# EAGLE design USB2RS485 (EAGLE 6.2)
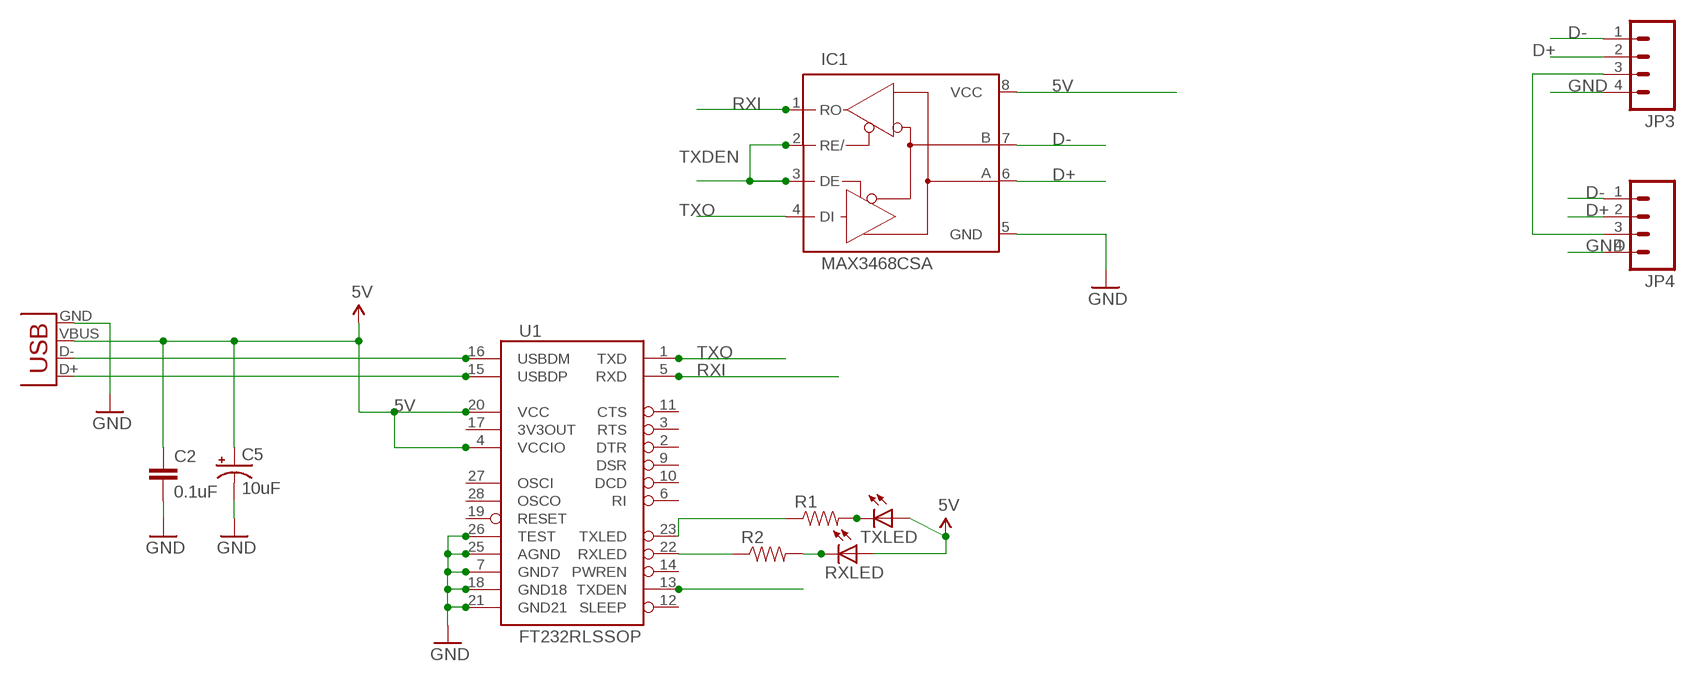
[diagram p0: schematic, sheet 1]

## Parts
C2  0.1uF  CAP0402-CAP  [0402-CAP]
C5  10uF  CAP_POL1206  [EIA3216]
IC1  MAX3468CSA  [SO08]
JP3  M04LOCK_LONGPADS  [1X04_LOCK_LONGPADS]
JP4  M04LOCK_LONGPADS  [1X04_LOCK_LONGPADS]
R1  RESISTOR0603-RES  [0603-RES]
R2  RESISTOR0603-RES  [0603-RES]
RXLED  LED0603  [LED-0603]
TXLED  LED0603  [LED-0603]
U1  FT232RLSSOP  [SSOP28DB]
X2  USB-SMD-NS  [USB-MINIB-NOSTOP]

## Nets
5V: C2.1 C5.A(+) IC1.8(VCC) RXLED.A TXLED.A U1.4(VCCIO) U1.20(VCC) X2.VBUS
D+: IC1.6(A) JP3.2 JP4.2
D-: IC1.7(B) JP3.1 JP4.1
GND [power]: C2.2 C5.C(-) IC1.5(GND) JP3.4 JP4.4 U1.7(GND7) U1.18(GND18) U1.21(GND21) U1.25(AGND) U1.26(TEST) X2.GND
N$1: R1.1 U1.23(TXLED)
N$2: R2.1 U1.22(RXLED)
N$3: R1.2 TXLED.C
N$4: JP3.3 JP4.3
N$6: R2.2 RXLED.C
RXI: IC1.1(RO) U1.5(RXD)
TXDEN: IC1.2(RE/) IC1.3(DE) U1.13(TXDEN)
TXO: IC1.4(DI) U1.1(TXD)
USB_D+: U1.15(USBDP) X2.D+
USB_D-: U1.16(USBDM) X2.D-
Unconnected: U1.2(DTR) U1.3(RTS) U1.6(RI) U1.9(DSR) U1.10(DCD) U1.11(CTS) U1.12(SLEEP) U1.14(PWREN) U1.17(3V3OUT) U1.19(RESET) U1.27(OSCI) U1.28(OSCO)

## Library data of the parts
C2 = SparkFun:CAP: Capacitor Standard 0603 ceramic capacitor, and 0.1" leaded capacitor.
C5 = SparkFun:CAP_POL: Capacitor Polarized These are standard SMD and PTH capacitors. Normally 10uF, 47uF, and 100uF in electrolytic and tantalum varieties. Always verify the external diameter of the through hole cap, it varies with capacity, voltage, and manufacturer. The EIA devices should be standard.
IC1 = maxim:MAX34*: +5V, Fail-Safe, 40Mbps, Profibus RS-485/RS-422 Transceivers Source: MAX3465-MAX3469.pdf; MPN: MAX3468CSA+; OC_FARNELL: unknown; OC_NEWARK: 76K6721
JP3 JP4 = SparkFun-Connectors:M04: Header 4 Standard 4-pin 0.1" header. Use with straight break away headers (SKU : PRT-00116), right angle break away headers (PRT-00553), swiss pins (PRT-00743), machine pins (PRT-00117), and female headers (PRT-00115). Molex polarized connector foot print use with SKU : PRT-08231 with associated crimp pins and housings. 1MM SMD Version SKU: PRT-10208
R1 R2 = SparkFun-Passives:RESISTOR: Resistor Basic schematic elements and footprints for 0603, 1206, and PTH resistors.
RXLED TXLED = SparkFun-LED:LED: LEDs Standard schematic elements and footprints for 5mm, 3mm, 1206, and 0603 sized LEDs. 5mm - Spark Fun Electronics SKU : COM-00529 (and others)
U1 = SparkFun:FT232RL: USB UART FT232RL 4th Generation USB UART (USB <-> Serial) Controller. Spark Fun Electronics SKU : COM-00650
X2 = SparkFun:USB: USB Connectors USB-B-PTH is fully proven SKU : PRT-00139 USB-miniB is fully proven SKU : PRT-00587 USB-A-PCB is untested. USB-A-H is throughly reviewed, but untested. Spark Fun Electronics SKU : PRT-00437 USB-B-SMT is throughly reviewed, but untested. Needs silkscreen touching up. USB-A-S has not been used/tested USB-MB-H has not been used/tested

## Net classes
0 default: width 0.203 mm
1 power: width 0.254 mm

## Board
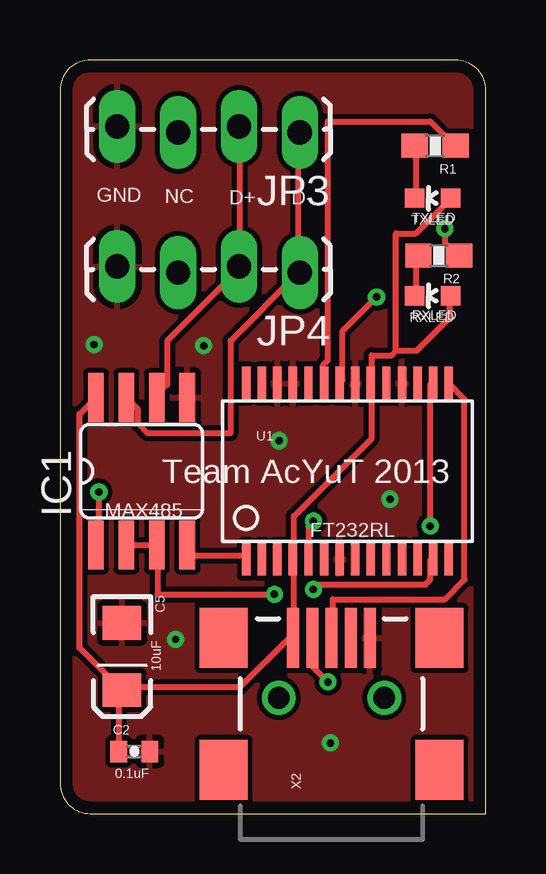
[diagram p1: board, top side]
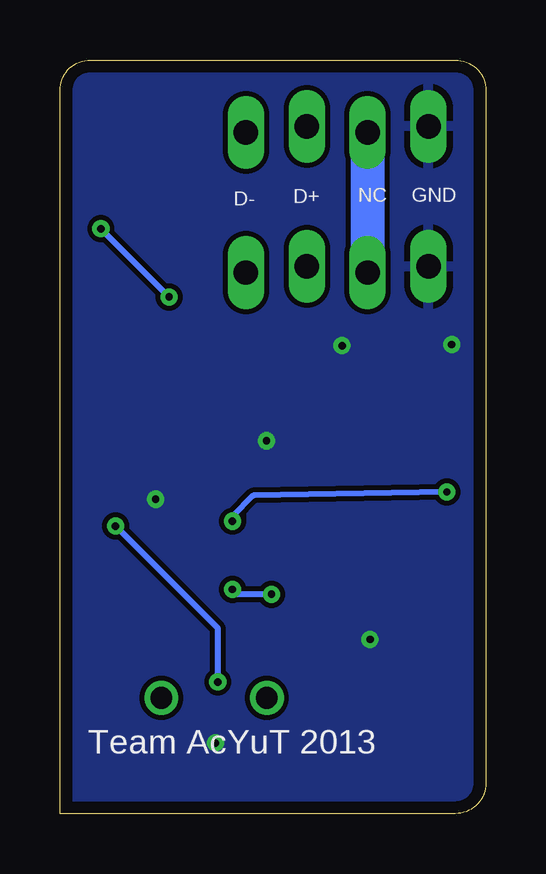
[diagram p2: board, bottom side, seen from below]

Size 17.76 x 31.42 mm. Coordinates in mm from the lower left corner, seen from the top.
Outline: 16.49,31.42 1.27,31.42 arc90 0,30.15 0,1.27 arc90 1.27,0 17.76,0 17.76,30.15 arc90 16.49,31.42
Copper layers (1*16): Top 0.035mm / dielectric 1.5mm / Bottom 0.035mm
Design rules: minimum track width 10mil, minimum drill 12mil, track to track 8mil, track to pad 8mil, pad to pad 8mil, via to via 8mil, smd to smd 8mil, copper to edge 20mil, drill to drill 8mil, minimum pad ring 10mil, minimum via ring 8mil, stop-mask expansion 4mil, vias tented up to drill 13mil, thermal gap 10mil

### Footprints (pad centres in the part's own frame; a part is rotated, then mirrored left to right if it is on the bottom)
0402-CAP = smd 0.7 x 0.9: 1 -0.65,0; 2 0.65,0
EIA3216 = smd 1.4 x 1.6: A 1.4,0; C -1.4,0
SO08 = smd 0.66 x 2.032: 1 -1.905,-3.073; 2 -0.635,-3.073; 3 0.635,-3.073; 4 1.905,-3.073; 5 1.905,3.073; 6 0.635,3.073; 7 -0.635,3.073; 8 -1.905,3.073
1X04_LOCK_LONGPADS = drill 1.016 long: 1 0,0; 2 2.54,-0.254; 3 5.08,0; 4 7.62,-0.254
0603-RES = smd 1.1 x 1: 1 -0.85,0; 2 0.85,0
LED-0603 = smd 0.8 x 0.8: A 0,-0.75; C 0,0.75
SSOP28DB = smd 0.348 x 1.397: 1 -4.225,-3.656; 2 -3.575,-3.656; 3 -2.925,-3.656; 4 -2.275,-3.656; 5 -1.625,-3.656; 6 -0.975,-3.656; 7 -0.325,-3.656; 8 0.325,-3.656; 9 0.975,-3.656; 10 1.625,-3.656; 11 2.275,-3.656; 12 2.925,-3.656; 13 3.575,-3.656; 14 4.225,-3.656; 15 4.225,3.656; 16 3.575,3.656; 17 2.925,3.656; 18 2.275,3.656; 19 1.625,3.656; 20 0.975,3.656; 21 0.325,3.656; 22 -0.325,3.656; 23 -0.975,3.656; 24 -1.625,3.656; 25 -2.275,3.656; 26 -2.925,3.656; 27 -3.575,3.656; 28 -4.225,3.656
USB-MINIB-NOSTOP = smd 2.5 x 0.5: D+ 2.5,0; D- 2.5,0.8; GND 2.5,-1.6; ID 2.5,-0.8; VBUS 2.5,1.6 | smd 2.5 x 2: G1 -3,-4.5; G2 -3,4.5; G3 2.5,4.5; G4 2.5,-4.5 | drill 0.9 pad 0.8: H1 0,2.2 | drill 0.9 pad 0.787: H2 0,-2.2

### Placement (x,y rotation side)
C2  3.1,2.59 0 top
C5  2.59,6.55 270 top
IC1  3.4,14.27 0 top
JP3  10.01,28.4 180 top
JP4  10.01,22.56 180 top
R1  15.65,27.84 180 top
R2  15.8,23.27 180 top
RXLED  15.54,21.59 90 top
TXLED  15.54,25.65 90 top
U1  11.99,14.27 0 top
X2  11.33,4.83 90 top

### Tracks (layer width: path | path; a pad name or v marks a point on that pad's centre or on a via)
5V
  Top 0.254: 14.02,19.3 13.82,19.1 13.01,19.1 13.01,18.09 U1.20 13.01,17.88 13.01,15.65 9.75,12.39 9.75,10.77 U1.4 9.75,10.57 9.75,7.52 X2.VBUS 9.55,7.32 7.52,5.28 2.64,5.28 C5.A | 14.02,19.3 14.88,19.3 16.26,20.68 16.26,21.54 RXLED.A | 14.02,19.3 14.02,24.18 14.83,24.18 16.26,25.6 TXLED.A | C2.1 2.44,2.64 2.44,5.08 C5.A | IC1.8 0.81,16.66 0.81,6.91 2.44,5.28 C5.A
D+
  Top 0.254: IC1.6 4.06,17.48 4.47,17.88 4.47,19.71 7.32,22.55 7.32,22.76 JP4.2 7.52,22.96 7.52,28.65 JP3.2
D-
  Top 0.254: IC1.7 3.25,16.87 3.25,16.26 3.66,15.85 7.11,15.85 7.11,19.71 9.96,22.55 | 9.96,22.55 9.96,28.25 JP3.1 | 9.96,22.55 JP4.1
GND  (via drill 0.3)
  other vias: 1.42,19.56 13.77,13.11 9.14,15.54 11.28,2.95 5.99,19.51 4.83,7.26
  pour Top: 17.53,0.25 -0.08,0 0.17,31.1 17.53,31.09
  pour Bottom: 17.48,31.39 17.58,0.1 1.37,0.1 arc-90 0.1,1.37 0,31.09
N$1
  Top 0.254: R1.1 16.46,27.84 15.44,28.85 11.18,28.85 11.18,18.9 10.97,18.69 10.97,18.09 U1.23
N$2  (via drill 0.3)
  Top 0.254: v16.05,24.38 16.05,23.77 16.46,23.37 R2.1 | v13.21,21.54 11.79,20.12 11.79,18.09 U1.22
  Bottom 0.254: v13.21,21.54 v16.05,24.38
N$3
  Top 0.254: TXLED.C 14.83,25.81 14.83,27.84 R1.2
N$4
  Bottom 1.422: JP3.3 JP4.3
N$6
  Top 0.254: 14.83,21.54 RXLED.C 14.83,21.74 14.83,23.16 R2.2
RXI  (via drill 0.3)
  Top 0.254: v10.57,12.19 10.36,11.99 10.36,10.77 U1.5 | v1.63,13.41 1.63,11.38 IC1.1
  Bottom 0.254: v1.63,13.41 9.7,13.26 10.57,12.39 v10.57,12.19
TXDEN  (via drill 0.3)
  Top 0.254: v10.57,9.35 10.57,9.55 15.24,9.55 15.44,9.75 15.44,10.57 U1.13 | v8.94,9.14 4.06,9.14 4.06,11.18 IC1.3 3.86,11.18 2.85,11.18 IC1.2
  Bottom 0.254: v10.57,9.35 10.36,9.14 v8.94,9.14
TXO
  Top 0.254: U1.1 7.72,10.77 5.49,10.77 5.49,11.18 IC1.4
USB_D+
  Top 0.254: U1.15 16.26,17.88 16.87,17.27 16.87,9.75 16.05,8.94 11.38,8.94 11.38,7.52 X2.D+
USB_D-  (via drill 0.3)
  Top 0.254: v15.44,11.99 15.44,17.88 U1.16 | v11.18,5.49 10.57,6.1 10.57,7.32 X2.D-
  Bottom 0.254: v15.44,11.99 11.18,7.72 v11.18,5.49

### Text on the board
tPlace: GND | NC | D+ | D- | TXLED | RXLED | Team AcYuT 2013 | MAX485 | FT232RL | 10uF | 0.1uF
bPlace: GND | NC | D+ | D- | Team AcYuT 2013